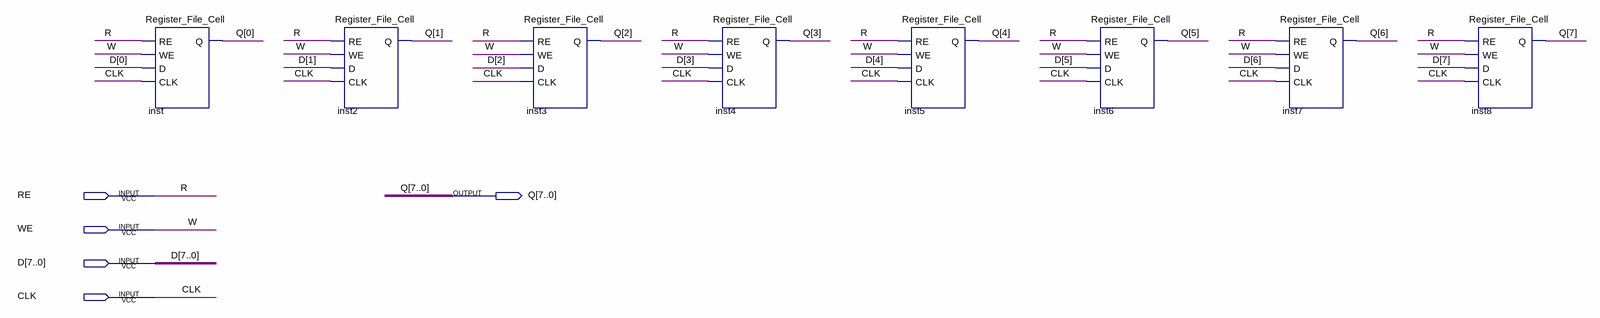
[diagram p0: schematic sheet]
// Quartus schematic Register_File_8x1.bdf as structural Verilog: 8 symbols, 5 pins
module Register_File_8x1 (
  input  RE,
  input  WE,
  input  [7:0] D,
  input  CLK,
  output [7:0] Q
);

  Register_File_Cell inst (.RE(RE), .WE(WE), .D(D[0]), .CLK(CLK), .Q(Q[0]));
  Register_File_Cell inst2 (.RE(RE), .WE(WE), .D(D[1]), .CLK(CLK), .Q(Q[1]));
  Register_File_Cell inst3 (.RE(RE), .WE(WE), .D(D[2]), .CLK(CLK), .Q(Q[2]));
  Register_File_Cell inst4 (.RE(RE), .WE(WE), .D(D[3]), .CLK(CLK), .Q(Q[3]));
  Register_File_Cell inst5 (.RE(RE), .WE(WE), .D(D[4]), .CLK(CLK), .Q(Q[4]));
  Register_File_Cell inst6 (.RE(RE), .WE(WE), .D(D[5]), .CLK(CLK), .Q(Q[5]));
  Register_File_Cell inst7 (.RE(RE), .WE(WE), .D(D[6]), .CLK(CLK), .Q(Q[6]));
  Register_File_Cell inst8 (.RE(RE), .WE(WE), .D(D[7]), .CLK(CLK), .Q(Q[7]));

  // Other names for the same wires on the sheet: R = RE; W = WE
endmodule
